# Altium schematic sheet treehopper.SchDoc
size Letter
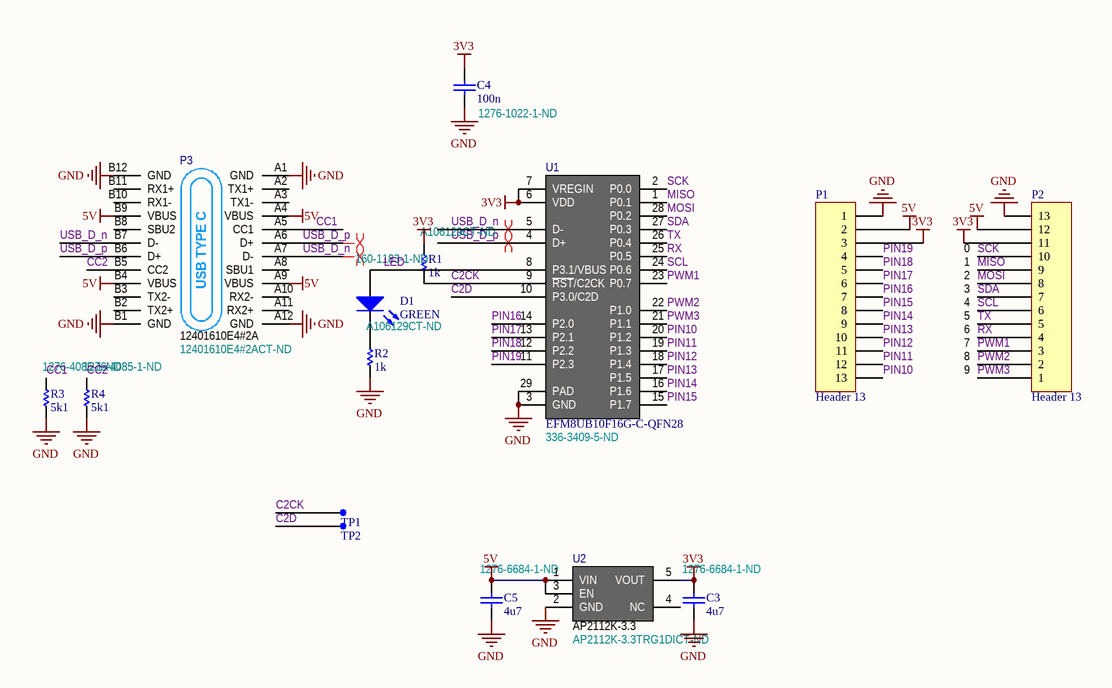
[diagram p0: treehopper.SchDoc]

## Parts
C3  4u7  Supplier Part Number 1: 1276-6684-1-ND  [CAPC1608N]
C4  100n  Supplier Part Number 1: 1276-1022-1-ND  [CAPC1005N]
C5  4u7  Supplier Part Number 1: 1276-6684-1-ND  [CAPC1608N]
D1  GREEN  Supplier Part Number 1: 160-1183-1-ND  [LTST-C190GKT_NO_SILK]
P1  Header 13  [HDR1X13CASTELATED]
P2  Header 13  [HDR1X13CASTELATED]
P3  12401610E4#2A  Supplier Part Number 1: 12401610E4#2ACT-ND  [12401610E4#2A]
R1  1k  Supplier Part Number 1: A106129CT-ND  [RESC1005N]
R2  1k  Supplier Part Number 1: A106129CT-ND  [RESC1005N]
R3  5k1  Supplier Part Number 1: 1276-4085-1-ND  [RESC1005N]
R4  5k1  Supplier Part Number 1: 1276-4085-1-ND  [RESC1005N]
TP1  TESTPOINT  [TESTPOINT100]  (value not drawn)  (no BOM)
TP2  TESTPOINT  [TESTPOINT100]  (value not drawn)  (no BOM)
U1  EFM8UB10F16G-C-QFN28  Supplier Part Number 1: 336-3409-5-ND  [QFN50P500X500X80_HS-29N_NO_SILK]
U2  AP2112K-3.3  Supplier Part Number 1: AP2112K-3.3TRG1DICT-ND  [SOT23-5AN-no-silk]

## Nets
3V3: C3.2 C4.2 P1.3 P2.11 R1.2 U1.6(VDD) U1.7(VREGIN) U2.5(VOUT)
5V: C5.2 P1.2 P2.12 P3.A4(VBUS) P3.A9(VBUS) P3.B4(VBUS) P3.B9(VBUS) U2.1(VIN) U2.3(EN)
GND: C3.1 C4.1 C5.1 P1.1 P2.13 P3.A1(GND) P3.A12(GND) P3.B1(GND) P3.B12(GND) R2.1 R3.1 R4.1 U1.3(GND) U1.29(PAD) U2.2(GND)
C2CK: R1.1 TP1.1(TP) U1.9(~{RST}/C2CK)
C2D: TP2.1(TP) U1.10(P3.0/C2D)
CC1: P3.A5(CC1) R3.2
CC2: P3.B5(CC2) R4.2
LED: D1.1(A) U1.8(P3.1/VBUS)
MISO: P2.9 U1.1(P0.1)
MOSI: P2.8 U1.28(P0.2)
PIN10: P1.13 U1.20(P1.2)
PIN11: P1.12 U1.19(P1.3)
PIN12: P1.11 U1.18(P1.4)
PIN13: P1.10 U1.17(P1.5)
PIN14: P1.9 U1.16(P1.6)
PIN15: P1.8 U1.15(P1.7)
PIN16: P1.7 U1.14(P2.0)
PIN17: P1.6 U1.13(P2.1)
PIN18: P1.5 U1.12(P2.2)
PIN19: P1.4 U1.11(P2.3)
PWM1: P2.3 U1.23(P0.7)
PWM2: P2.2 U1.22(P1.0)
PWM3: P2.1 U1.21(P1.1)
RX: P2.4 U1.25(P0.5)
SCK: P2.10 U1.2(P0.0)
SCL: P2.6 U1.24(P0.6)
SDA: P2.7 U1.27(P0.3)
TX: P2.5 U1.26(P0.4)
USB_D_n: P3.A7(D-) P3.B7(D-) U1.5(D-)
USB_D_p: P3.A6(D+) P3.B6(D+) U1.4(D+)
NetD1_2: D1.2(K) R2.2

Not connected (* = marked no-connect by the designer): P3 A2(TX1+) A3(TX1-) A8(SBU1) A10(RX2-) A11(RX2+) B2(TX2+) B3(TX2-) B8(SBU2) B10(RX1-) B11(RX1+); U2 4(NC)

## Layout directives
differential pair: USB_D_n, USB_D_p

## Notes on the sheet
- 1
- 0
- 2
- 3
- 4
- 5
- 6
- 7
- 8
- 9
- Revision
- Project:
- Sheet
- of
- Jay Carlson
  4442 Grandview Blvd
  Lincoln NE 68521-2026
- (in symbol 12401610E4#2A) USB TYPE C

## Library data of the parts
C3 C5 = Cap Semi: CAP SEMI 4U7 10V 0603; Published: 8-Jun-2000; LatestRevisionDate: 29-May-2009; LatestRevisionNote: IPC-7351 Footprint Added.; PackageReference: C1206; Publisher: Altium Limited; PackageDescription: Chip Capacitor; Supplier 1: Digi-Key
C4 = Cap Semi: CAP SEMI 0U1 10V 0402; Published: 8-Jun-2000; LatestRevisionDate: 29-May-2009; LatestRevisionNote: IPC-7351 Footprint Added.; PackageReference: C1206; Publisher: Altium Limited; PackageDescription: Chip Capacitor; Supplier 1: Digi-Key
D1 = LED_GREEN: LED GREEN 0603; Published: 8-Jun-2000; LatestRevisionDate: 17-Jul-2002; LatestRevisionNote: Re-released for DXP Platform.; PackageVersion: Feb-2002; PackageReference: 3.2X1.6X1.1; Publisher: Altium Limited; PackageDescription: SM LED; 2 Flat Leads; Supplier 1: Digi-Key
P1 P2 = Header 13: DNI; LatestRevisionDate: 17-Jul-2002; LatestRevisionNote: Re-released for DXP Platform.; Publisher: Altium Limited
P3 = 12401610E4#2A: USB TYPE-C RECEPTACLE; Manufacturer: Amphenol Commercial Products; Connector Type: USB - C; Number of Contacts: 24; Specifications: USB 3.1, Superspeed+; Supplier 1: Digi-Key; Manufacturer Part Number: 12401610E4#2A; RoHS: RoHS Compliant; Category: Connectors, Interconnects; Stock 1: 6422; Pricing 1: 1=1.74, 10=1.577, 25=1.48, 50=1.4158, 100=1.3514, 250=1.22264, 500=1.12612 (USD); Packaging: Cut Tape (CT); Part Status: Active; Gender: Receptacle; Mounting Type: Surface Mount, Right Angle; Features: Board Guide; Ingress Protection: -; ComponentLink1URL: http://media.digikey.com/pdf/Data%20Sheets/Amphenol%20PDFs/USB-Type-C_Connectors.pdf; ComponentLink1Description: http://media.digikey.com/pdf/Data%20Sheets/Amphenol%20PDFs/USB-Type-C_Connectors.pdf
R1 R2 = Res Semi: RES SEMI 1K 0402; Published: 8-Jun-2000; LatestRevisionDate: 17-Jul-2002; LatestRevisionNote: Re-released for DXP Platform.; PackageReference: AXIAL-0.5; Publisher: Altium Limited; PackageDescription: Axial Device, Thru-Hole; 2 Leads; 0.5 in Pin Spacing; Supplier 1: Digi-Key
R3 R4 = Res Semi: RES SEMI 5K1 1% 0402; Published: 8-Jun-2000; LatestRevisionDate: 17-Jul-2002; LatestRevisionNote: Re-released for DXP Platform.; PackageReference: AXIAL-0.5; Publisher: Altium Limited; PackageDescription: Axial Device, Thru-Hole; 2 Leads; 0.5 in Pin Spacing; Supplier 1: Digi-Key
U1 = EFM8UB10F16G-B-QFN28: IC MCU EFM8UB10F16G-C-QFN28 DATE CODE 1601 OR NEWER; Manufacturer: Silicon Labs; Core Size: 8-Bit; Speed: 50MHz; Connectivity: I²C, SMBus, SPI, UART/USART, USB; Peripherals: Brown-out Detect/Reset, POR, PWM, WDT; Number of I/O: 22; Program Memory Size: 16KB (16K x 8); Program Memory Type: FLASH; RAM Size: 2.25K x 8; Voltage - Supply (Vcc/Vdd): 2.2 V ~ 5.25 V; Data Converters: A/D 20x12b; Oscillator Type: Internal; Supplier 1: Digi-Key; Manufacturer Part Number: EFM8UB10F16G-C-QFN28; RoHS: RoHS Compliant; Category: Integrated Circuits (ICs); Stock 1: 99; Pricing 1: 1=1.25, 25=1.15, 100=1.0454, 1000=0.94082 (USD); Packaging: Tube; Core Processor: CIP-51 8051; EEPROM Size: -; Operating Temperature: -40°C ~ 85°C; Package / Case: 28-WFQFN Exposed Pad; Supplier Device Package: 28-QFN (5x5); ComponentLink1URL: http://www.silabs.com/Support%20Documents/TechnicalDocs/EFM8UB1_DataSheet.pdf; ComponentLink1Description: http://www.silabs.com/Support%20Documents/TechnicalDocs/EFM8UB1_DataSheet.pdf
U2 = AP2112K-3.3: AP2112 IC REG LDO 3.3V 0.6A SOT25; Manufacturer: Diodes Incorporated; Manufacturer Part Number: AP2112K-3.3TRG1; Regulator Topology: Positive Fixed; Current - Output: 600mA; Voltage - Dropout (Typical): 0.25V @ 600mA; Number of Regulators: 1; Voltage - Input: Up to 6V; Supplier 1: Digi-Key; RoHS: RoHS Compliant; Category: Integrated Circuits (ICs); Stock 1: 13320; Pricing 1: 1=0.56, 10=0.397, 25=0.3264, 100=0.2609, 250=0.19008, 500=0.15436, 1000=0.11866 (USD); Packaging: Cut Tape (CT); Voltage - Output: 3.3V; Current - Limit (Min): -; Operating Temperature: -40°C ~ 85°C; Mounting Type: Surface Mount; Package / Case: SC-74A, SOT-753; Supplier Device Package: SOT-23-5; ComponentLink1URL: http://www.diodes.com/datasheets/AP2112.pdf; ComponentLink1Description: http://www.diodes.com/datasheets/AP2112.pdf
TP1 TP2 = TESTPOINT: LatestRevisionDate: 17-Jul-2002; LatestRevisionNote: Re-released for DXP Platform.; Publisher: Altium Limited